# EAGLE design Pi64 (EAGLE 9.2.1)

## Sheet 1 of 4
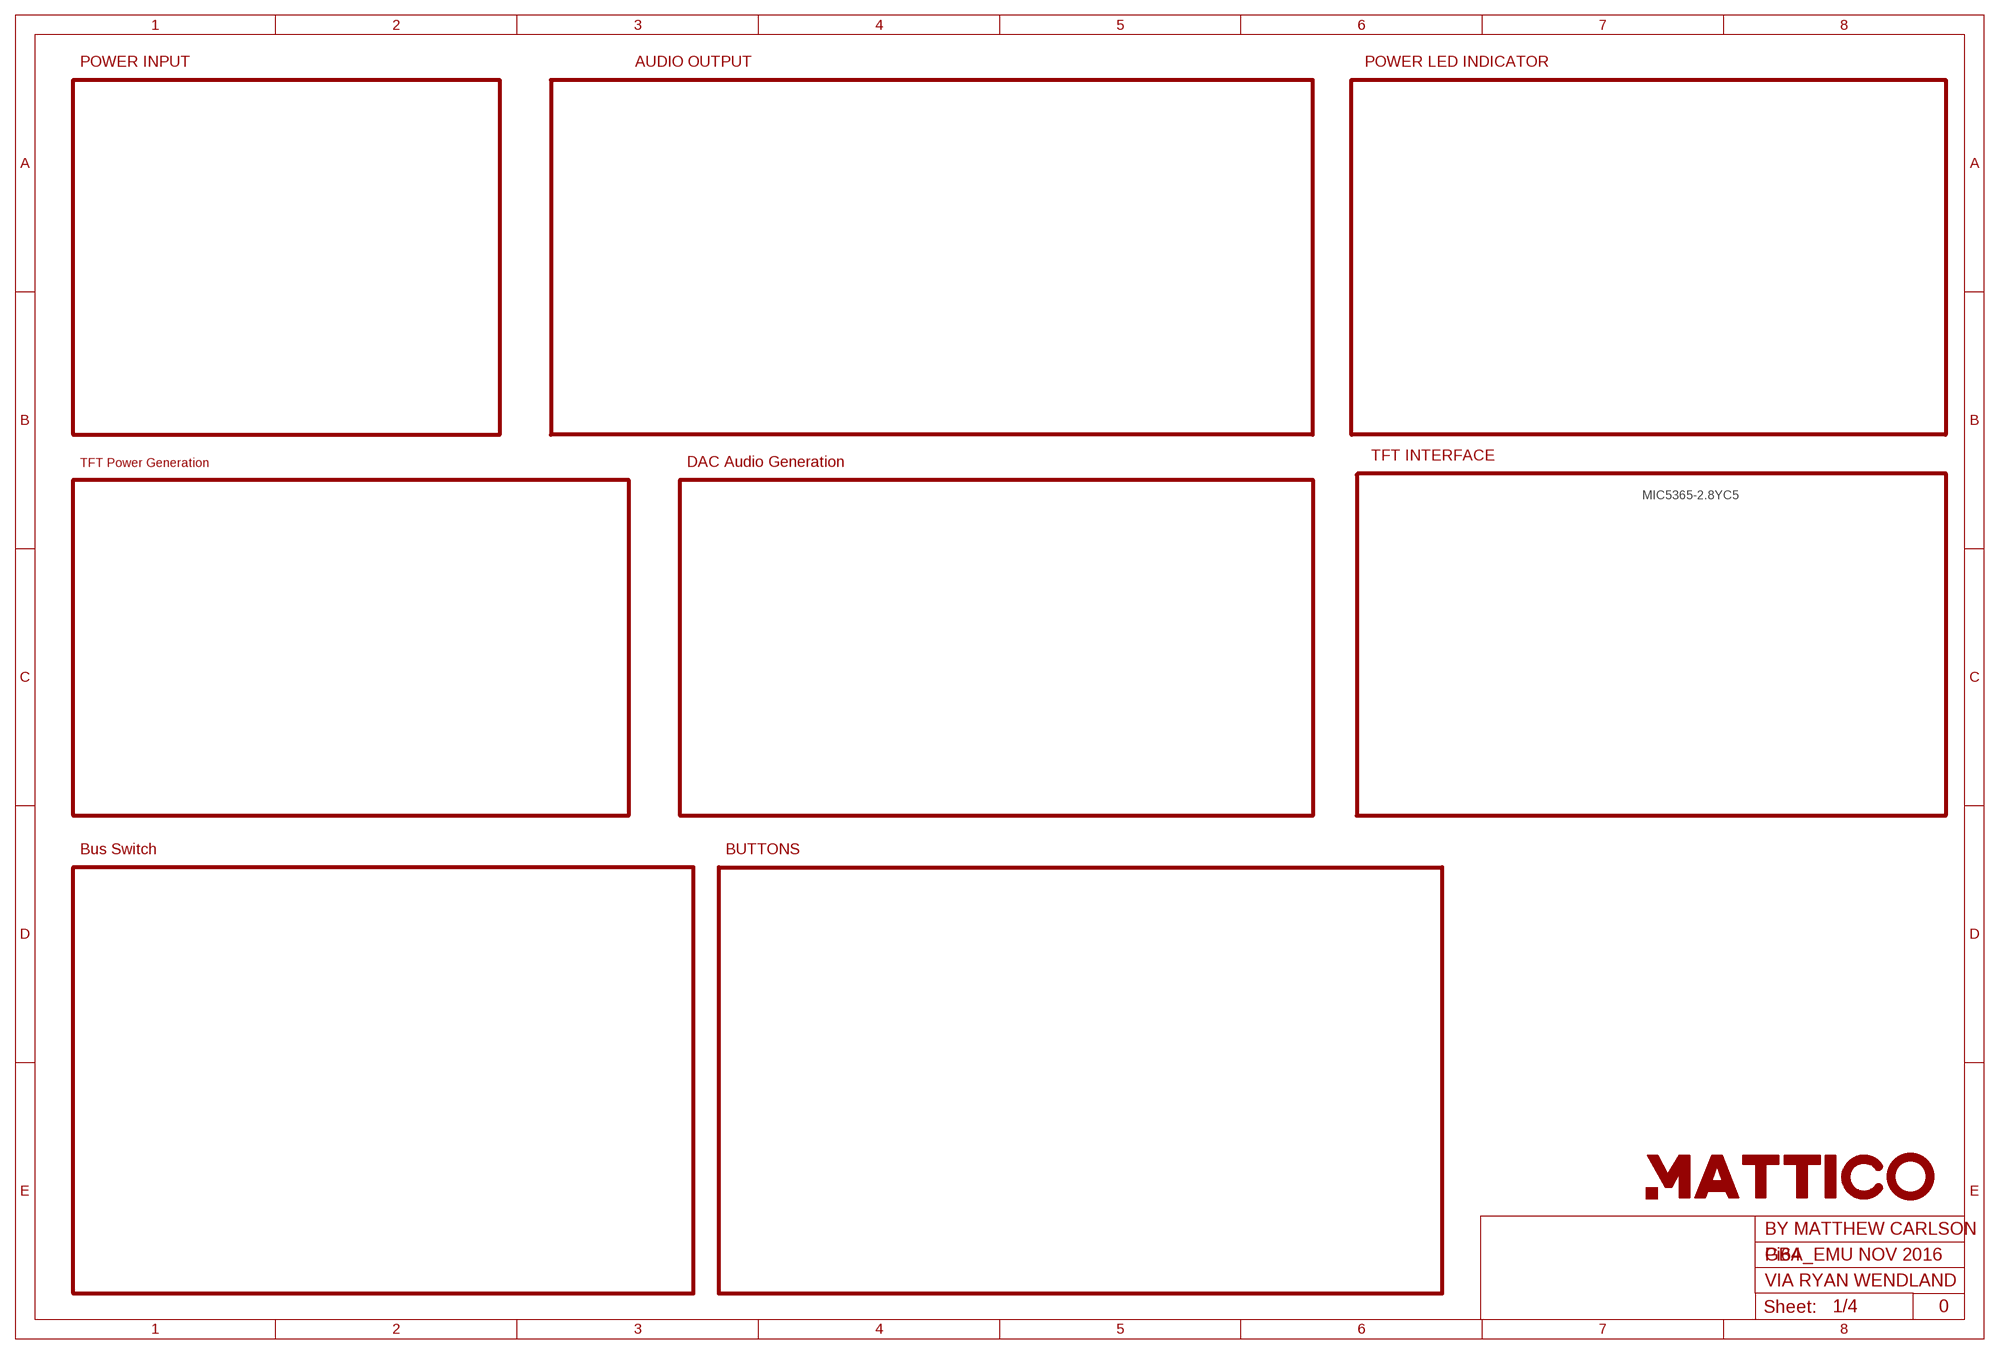
[diagram p0: schematic, sheet 1]

### Parts
U$2  LOGO2INCH_SVG  [LOGO_2INCH_SVG]

### Notes on the sheet
- POWER INPUT | AUDIO OUTPUT | POWER LED INDICATOR
- TFT INTERFACE
- TFT Power Generation | DAC Audio Generation
- MIC5365-2.8YC5
- Bus Switch | BUTTONS
- BY MATTHEW CARLSON
- GBA_EMU NOV 2016
- VIA RYAN WENDLAND
- 0

## Sheet 2 of 4
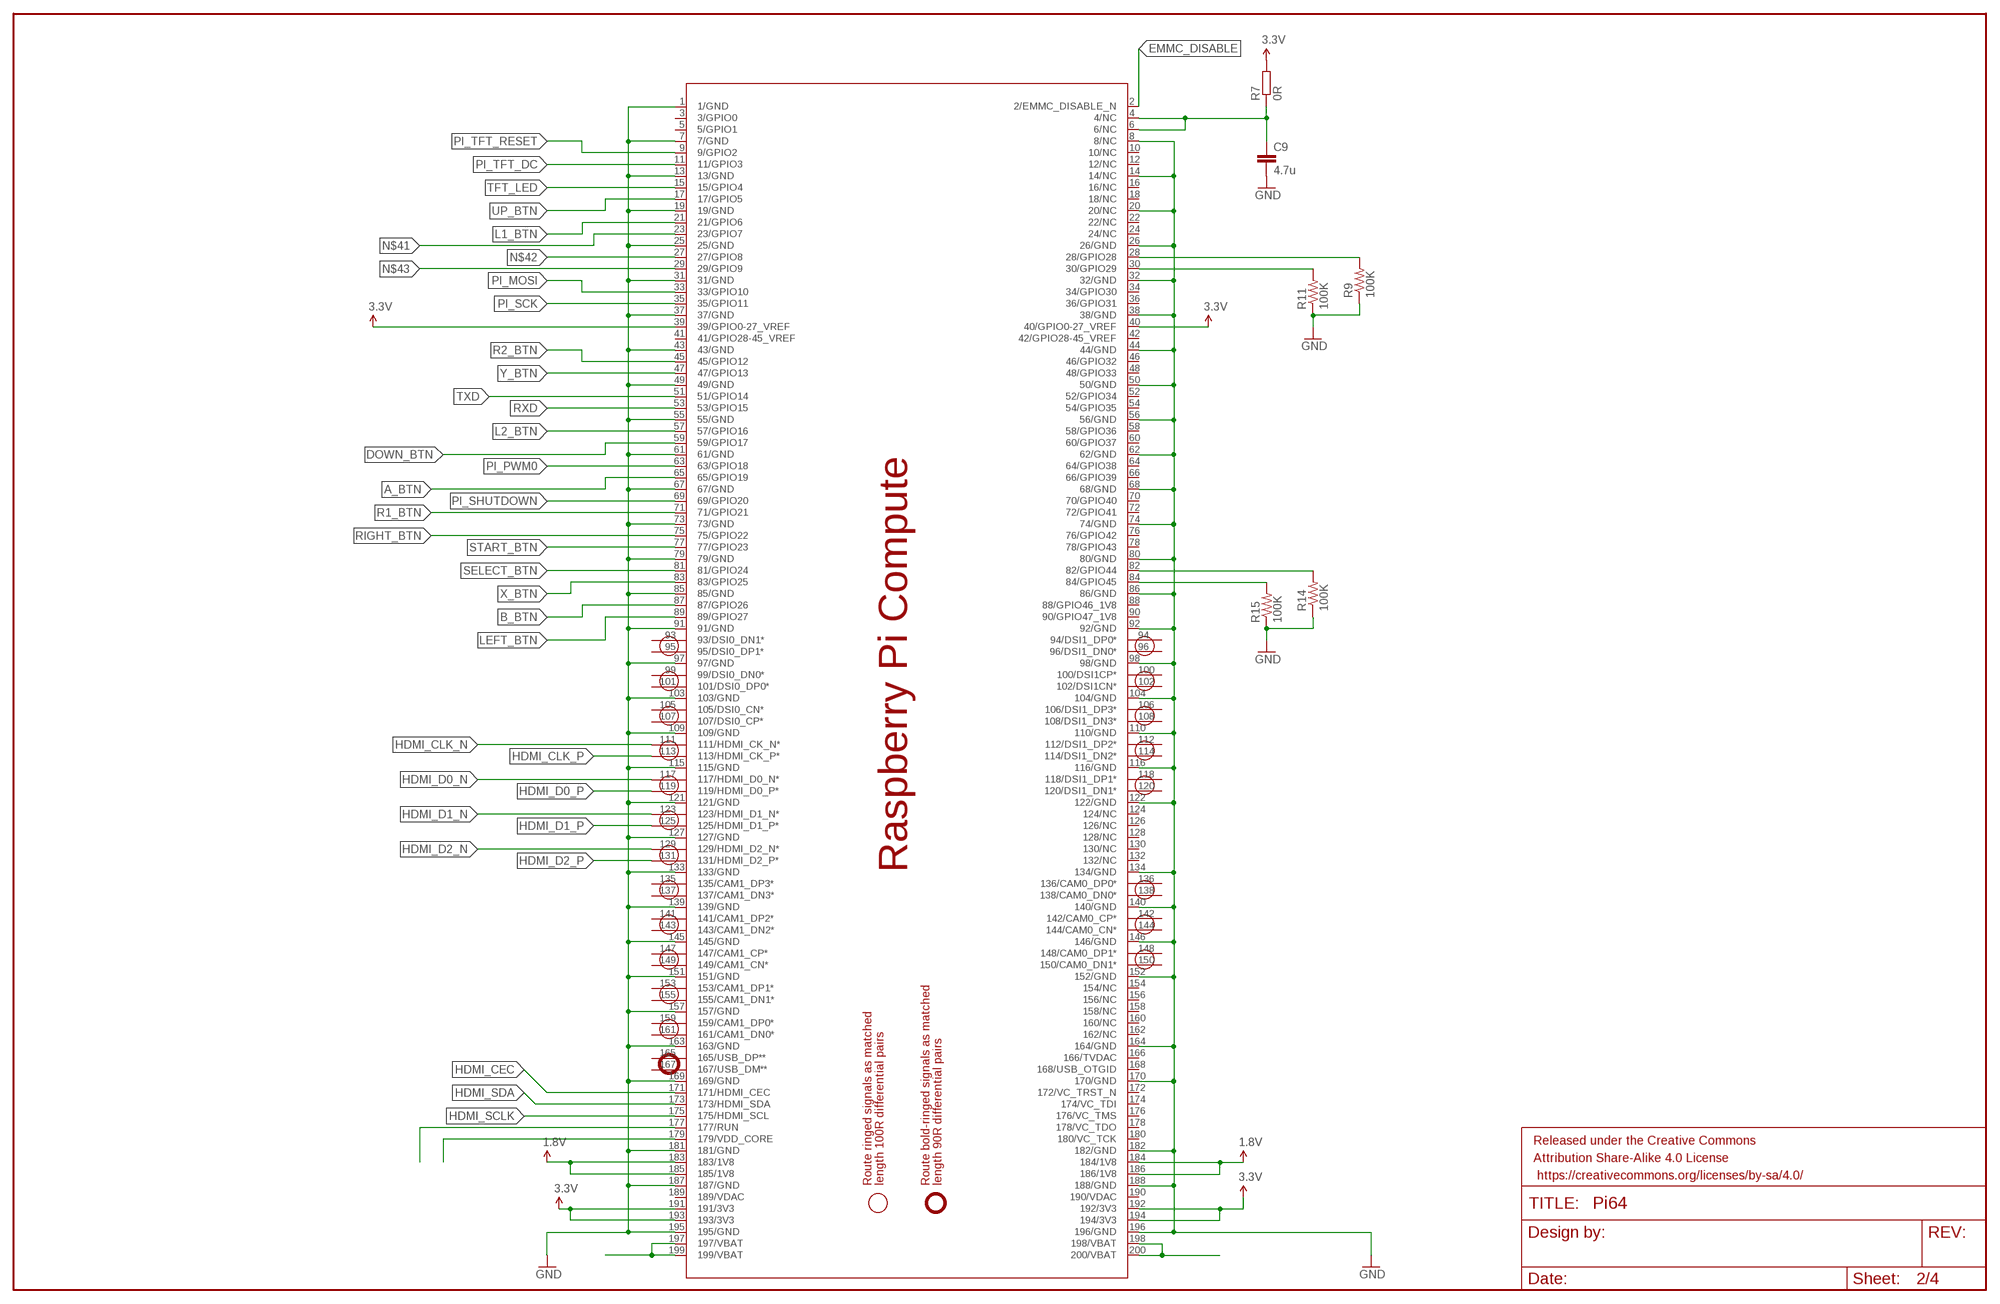
[diagram p1: schematic, sheet 2]

### Parts
C9  4.7u  C-EUC1608  [C1608]
FRAME2  FRAME-LEDGER  [CREATIVE_COMMONS]
PCB1  RPI_COMPUTE  [RPI_COMPUTE]
R7  0R  R-EU_R2012  [R2012]
R9  100K  R-US_R0805  [R0805]
R11  100K  R-US_R0805  [R0805]
R14  100K  R-US_R0805  [R0805]
R15  100K  R-US_R0805  [R0805]

### Nets
1.8V: PCB1.183(183/1V8) PCB1.184(184/1V8) PCB1.185(185/1V8) PCB1.186(186/1V8) ; also sheet 3
3.3V: PCB1.39(39/GPIO0-27_VREF) PCB1.40(40/GPIO0-27_VREF) PCB1.191(191/3V3) PCB1.192(192/3V3) PCB1.193(193/3V3) PCB1.194(194/3V3) R7.2 ; also sheet 3
A_BTN: PCB1.65(65/GPIO19)
B_BTN: PCB1.87(87/GPIO26)
DOWN_BTN: PCB1.59(59/GPIO17)
EMMC_DISABLE: PCB1.2(2/EMMC_DISABLE_N)
GND: C9.2 PCB1.1(1/GND) PCB1.7(7/GND) PCB1.8(8/NC) PCB1.13(13/GND) PCB1.14(14/NC) PCB1.19(19/GND) PCB1.20(20/NC) PCB1.25(25/GND) PCB1.26(26/GND) PCB1.31(31/GND) PCB1.32(32/GND) PCB1.37(37/GND) PCB1.38(38/GND) PCB1.43(43/GND) PCB1.44(44/GND) PCB1.49(49/GND) PCB1.50(50/GND) PCB1.55(55/GND) PCB1.56(56/GND) PCB1.61(61/GND) PCB1.62(62/GND) PCB1.67(67/GND) PCB1.68(68/GND) PCB1.73(73/GND) PCB1.74(74/GND) PCB1.79(79/GND) PCB1.80(80/GND) PCB1.85(85/GND) PCB1.86(86/GND) PCB1.91(91/GND) PCB1.92(92/GND) PCB1.97(97/GND) PCB1.98(98/GND) PCB1.103(103/GND) PCB1.104(104/GND) PCB1.109(109/GND) PCB1.110(110/GND) PCB1.115(115/GND) PCB1.116(116/GND) PCB1.121(121/GND) PCB1.122(122/GND) PCB1.127(127/GND) PCB1.133(133/GND) PCB1.134(134/GND) PCB1.139(139/GND) PCB1.140(140/GND) PCB1.145(145/GND) PCB1.146(146/GND) PCB1.151(151/GND) PCB1.152(152/GND) PCB1.157(157/GND) PCB1.163(163/GND) PCB1.164(164/GND) PCB1.169(169/GND) PCB1.170(170/GND) PCB1.181(181/GND) PCB1.182(182/GND) PCB1.187(187/GND) PCB1.188(188/GND) PCB1.195(195/GND) PCB1.196(196/GND) R9.1 R11.1 R14.1 R15.1 ; also sheet 3
HDMI_CEC [diff pairs]: PCB1.171(171/HDMI_CEC)
HDMI_CLK_N [diff pairs]: PCB1.111(111/HDMI_CK_N*)
HDMI_CLK_P [diff pairs]: PCB1.113(113/HDMI_CK_P*)
HDMI_D0_N [diff pairs]: PCB1.117(117/HDMI_D0_N*)
HDMI_D0_P [diff pairs]: PCB1.119(119/HDMI_D0_P*)
HDMI_D1_N [diff pairs]: PCB1.123(123/HDMI_D1_N*)
HDMI_D1_P [diff pairs]: PCB1.125(125/HDMI_D1_P*)
HDMI_D2_N [diff pairs]: PCB1.129(129/HDMI_D2_N*)
HDMI_D2_P [diff pairs]: PCB1.131(131/HDMI_D2_P*)
HDMI_SCLK: PCB1.175(175/HDMI_SCL)
HDMI_SDA: PCB1.173(173/HDMI_SDA)
L1_BTN: PCB1.21(21/GPIO6)
L2_BTN: PCB1.57(57/GPIO16)
LEFT_BTN: PCB1.89(89/GPIO27)
N$1: C9.1 PCB1.4(4/NC) PCB1.6(6/NC) R7.1
N$17: PCB1.28(28/GPIO28) R9.2
N$20: PCB1.30(30/GPIO29) R11.2
N$26: R14.2
N$27: R15.2
N$30: PCB1.179(179/VDD_CORE)
N$35: PCB1.177(177/RUN)
N$36: PCB1.197(197/VBAT) PCB1.199(199/VBAT)
N$37: PCB1.198(198/VBAT) PCB1.200(200/VBAT)
N$41: PCB1.23(23/GPIO7)
N$42: PCB1.27(27/GPIO8)
N$43: PCB1.29(29/GPIO9)
PI_MOSI: PCB1.33(33/GPIO10)
PI_PWM0: PCB1.63(63/GPIO18)
PI_SCK: PCB1.35(35/GPIO11)
PI_SHUTDOWN: PCB1.69(69/GPIO20)
PI_TFT_DC: PCB1.11(11/GPIO3)
PI_TFT_RESET: PCB1.9(9/GPIO2)
R1_BTN: PCB1.71(71/GPIO21)
R2_BTN: PCB1.45(45/GPIO12)
RIGHT_BTN: PCB1.75(75/GPIO22)
RXD: PCB1.53(53/GPIO15)
SELECT_BTN: PCB1.81(81/GPIO24)
START_BTN: PCB1.77(77/GPIO23)
TFT_LED: PCB1.15(15/GPIO4)
TXD: PCB1.51(51/GPIO14)
UP_BTN: PCB1.17(17/GPIO5)
X_BTN: PCB1.83(83/GPIO25)
Y_BTN: PCB1.47(47/GPIO13)
Unconnected: PCB1.3(3/GPIO0) PCB1.5(5/GPIO1) PCB1.10(10/NC) PCB1.12(12/NC) PCB1.16(16/NC) PCB1.18(18/NC) PCB1.22(22/NC) PCB1.24(24/NC) PCB1.34(34/GPIO30) PCB1.36(36/GPIO31) PCB1.41(41/GPIO28-45_VREF) PCB1.42(42/GPIO28-45_VREF) PCB1.46(46/GPIO32) PCB1.48(48/GPIO33) PCB1.52(52/GPIO34) PCB1.54(54/GPIO35) PCB1.58(58/GPIO36) PCB1.60(60/GPIO37) PCB1.64(64/GPIO38) PCB1.66(66/GPIO39) PCB1.70(70/GPIO40) PCB1.72(72/GPIO41) PCB1.76(76/GPIO42) PCB1.78(78/GPIO43) PCB1.82(82/GPIO44) PCB1.84(84/GPIO45) PCB1.88(88/GPIO46_1V8) PCB1.90(90/GPIO47_1V8) PCB1.93(93/DSI0_DN1*) PCB1.94(94/DSI1_DP0*) PCB1.95(95/DSI0_DP1*) PCB1.96(96/DSI1_DN0*) PCB1.99(99/DSI0_DN0*) PCB1.100(100/DSI1CP*) PCB1.101(101/DSI0_DP0*) PCB1.102(102/DSI1CN*) PCB1.105(105/DSI0_CN*) PCB1.106(106/DSI1_DP3*) PCB1.107(107/DSI0_CP*) PCB1.108(108/DSI1_DN3*) PCB1.112(112/DSI1_DP2*) PCB1.114(114/DSI1_DN2*) PCB1.118(118/DSI1_DP1*) PCB1.120(120/DSI1_DN1*) PCB1.124(124/NC) PCB1.126(126/NC) PCB1.128(128/NC) PCB1.130(130/NC) PCB1.132(132/NC) PCB1.135(135/CAM1_DP3*) PCB1.136(136/CAM0_DP0*) PCB1.137(137/CAM1_DN3*) PCB1.138(138/CAM0_DN0*) PCB1.141(141/CAM1_DP2*) PCB1.142(142/CAM0_CP*) PCB1.143(143/CAM1_DN2*) PCB1.144(144/CAM0_CN*) PCB1.147(147/CAM1_CP*) PCB1.148(148/CAM0_DP1*) PCB1.149(149/CAM1_CN*) PCB1.150(150/CAM0_DN1*) PCB1.153(153/CAM1_DP1*) PCB1.154(154/NC) PCB1.155(155/CAM1_DN1*) PCB1.156(156/NC) PCB1.158(158/NC) PCB1.159(159/CAM1_DP0*) PCB1.160(160/NC) PCB1.161(161/CAM1_DN0*) PCB1.162(162/NC) PCB1.165(165/USB_DP**) PCB1.166(166/TVDAC) PCB1.167(167/USB_DM**) PCB1.168(168/USB_OTGID) PCB1.172(172/VC_TRST_N) PCB1.174(174/VC_TDI) PCB1.176(176/VC_TMS) PCB1.178(178/VC_TDO) PCB1.180(180/VC_TCK) PCB1.189(189/VDAC) PCB1.190(190/VDAC)

## Sheet 3 of 4
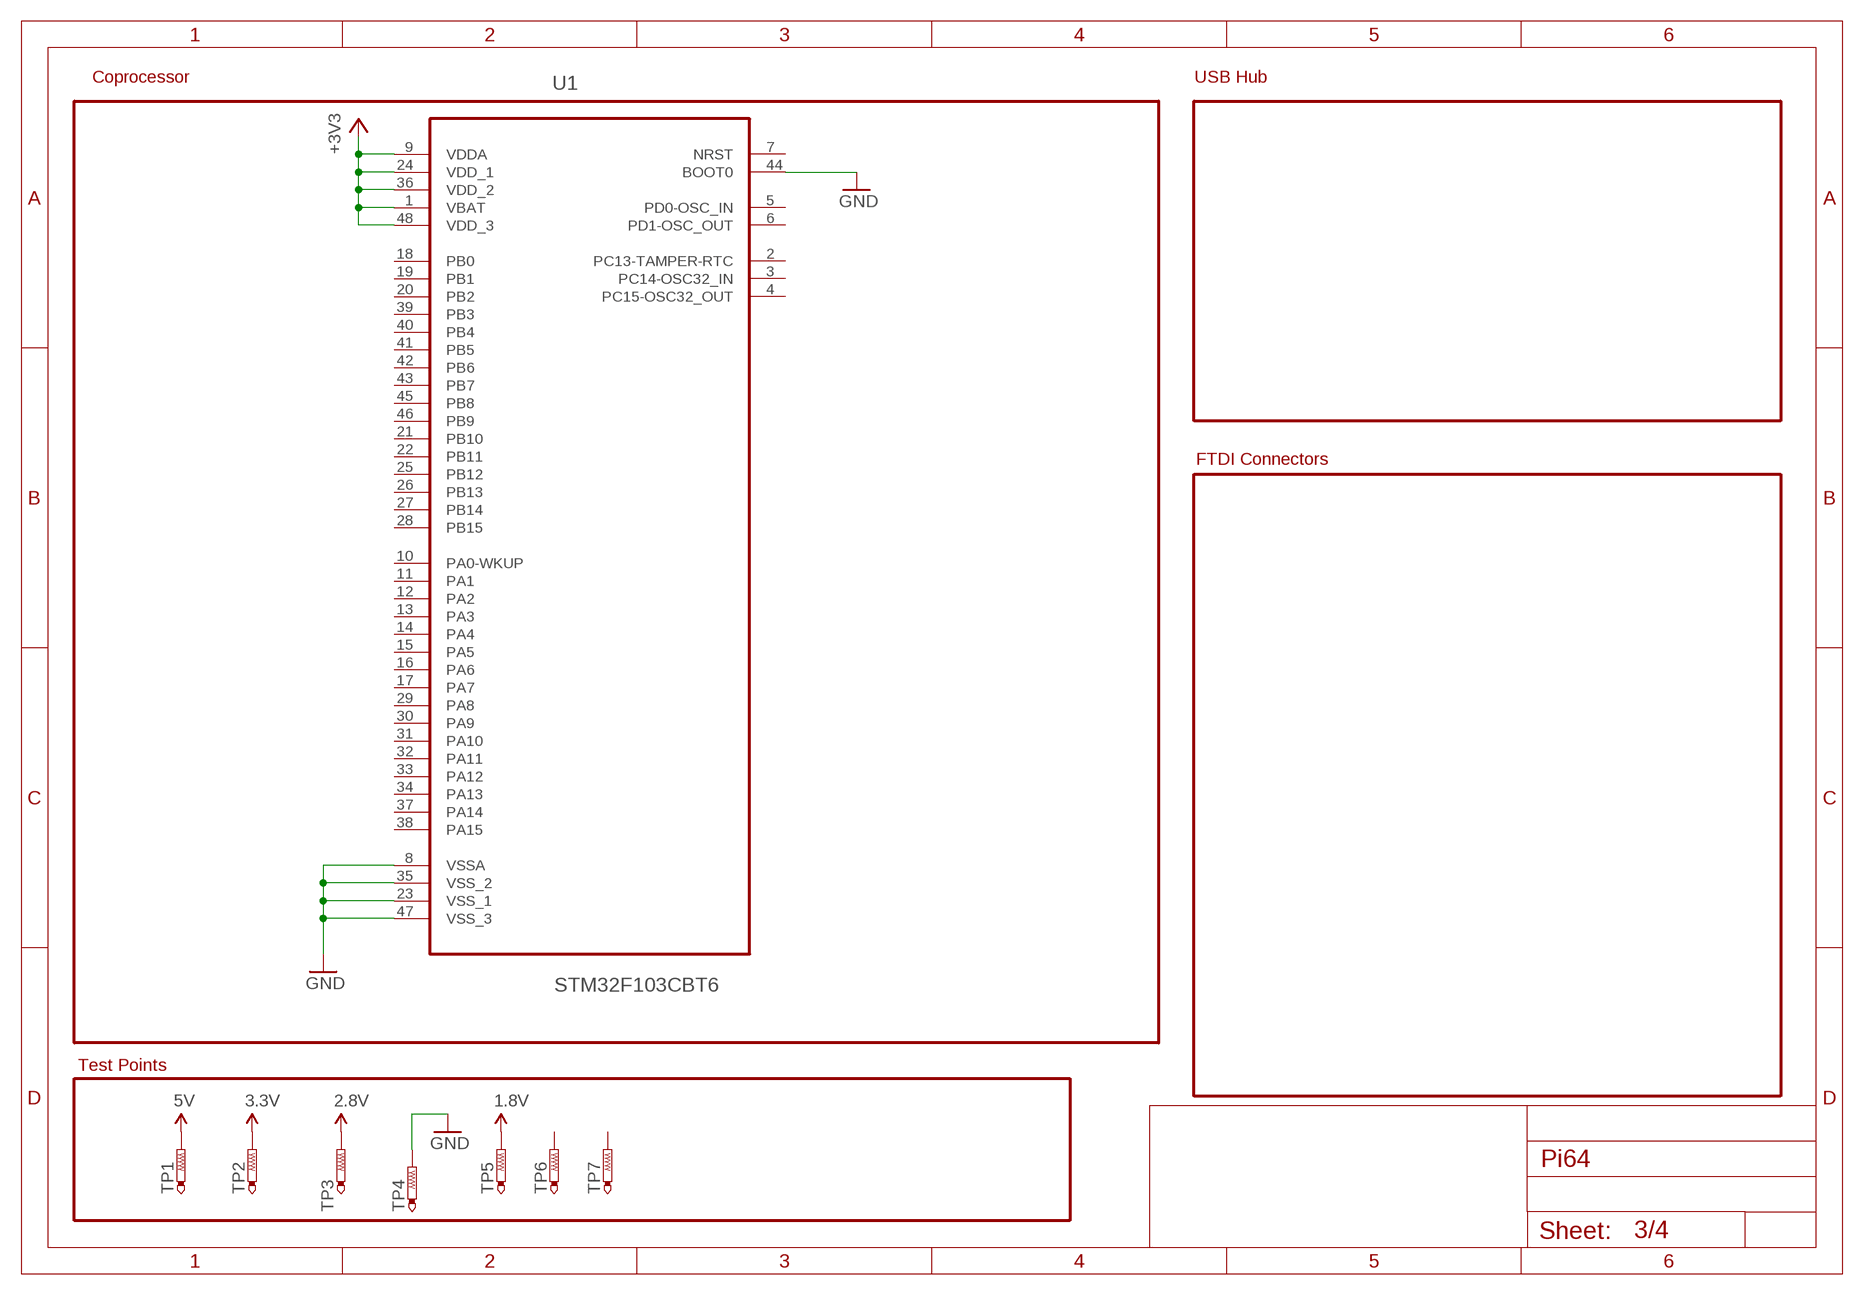
[diagram p2: schematic, sheet 3]

### Parts
TP1  PTR1TP12R  [TP12R]
TP2  PTR1TP12R  [TP12R]
TP3  PTR1TP12R  [TP12R]
TP4  PTR1TP12R  [TP12R]
TP5  PTR1TP12R  [TP12R]
TP6  PTR1TP12R  [TP12R]
TP7  PTR1TP12R  [TP12R]
U1  STM32F103CBT6  [QFP50P900X900X160-48N]

### Nets
1.8V: TP5.TP ; also sheet 2
2.8V: TP3.TP
3.3V: TP2.TP ; also sheet 2
5V: TP1.TP
+3V3: U1.1(VBAT) U1.9(VDDA) U1.24(VDD_1) U1.36(VDD_2) U1.48(VDD_3)
GND: TP4.TP U1.8(VSSA) U1.23(VSS_1) U1.35(VSS_2) U1.44(BOOT0) U1.47(VSS_3) ; also sheet 2
Unconnected: TP6.TP TP7.TP U1.2(PC13-TAMPER-RTC) U1.3(PC14-OSC32_IN) U1.4(PC15-OSC32_OUT) U1.5(PD0-OSC_IN) U1.6(PD1-OSC_OUT) U1.7(NRST) U1.10(PA0-WKUP) U1.11(PA1) U1.12(PA2) U1.13(PA3) U1.14(PA4) U1.15(PA5) U1.16(PA6) U1.17(PA7) U1.18(PB0) U1.19(PB1) U1.20(PB2) U1.21(PB10) U1.22(PB11) U1.25(PB12) U1.26(PB13) U1.27(PB14) U1.28(PB15) U1.29(PA8) U1.30(PA9) U1.31(PA10) U1.33(PA12) U1.34(PA13) U1.37(PA14) U1.38(PA15) U1.39(PB3) U1.40(PB4) U1.41(PB5) U1.42(PB6) U1.43(PB7) U1.45(PB8) U1.46(PB9)

### Notes on the sheet
- Coprocessor | USB Hub
- FTDI Connectors
- Test Points

## Sheet 4 of 4
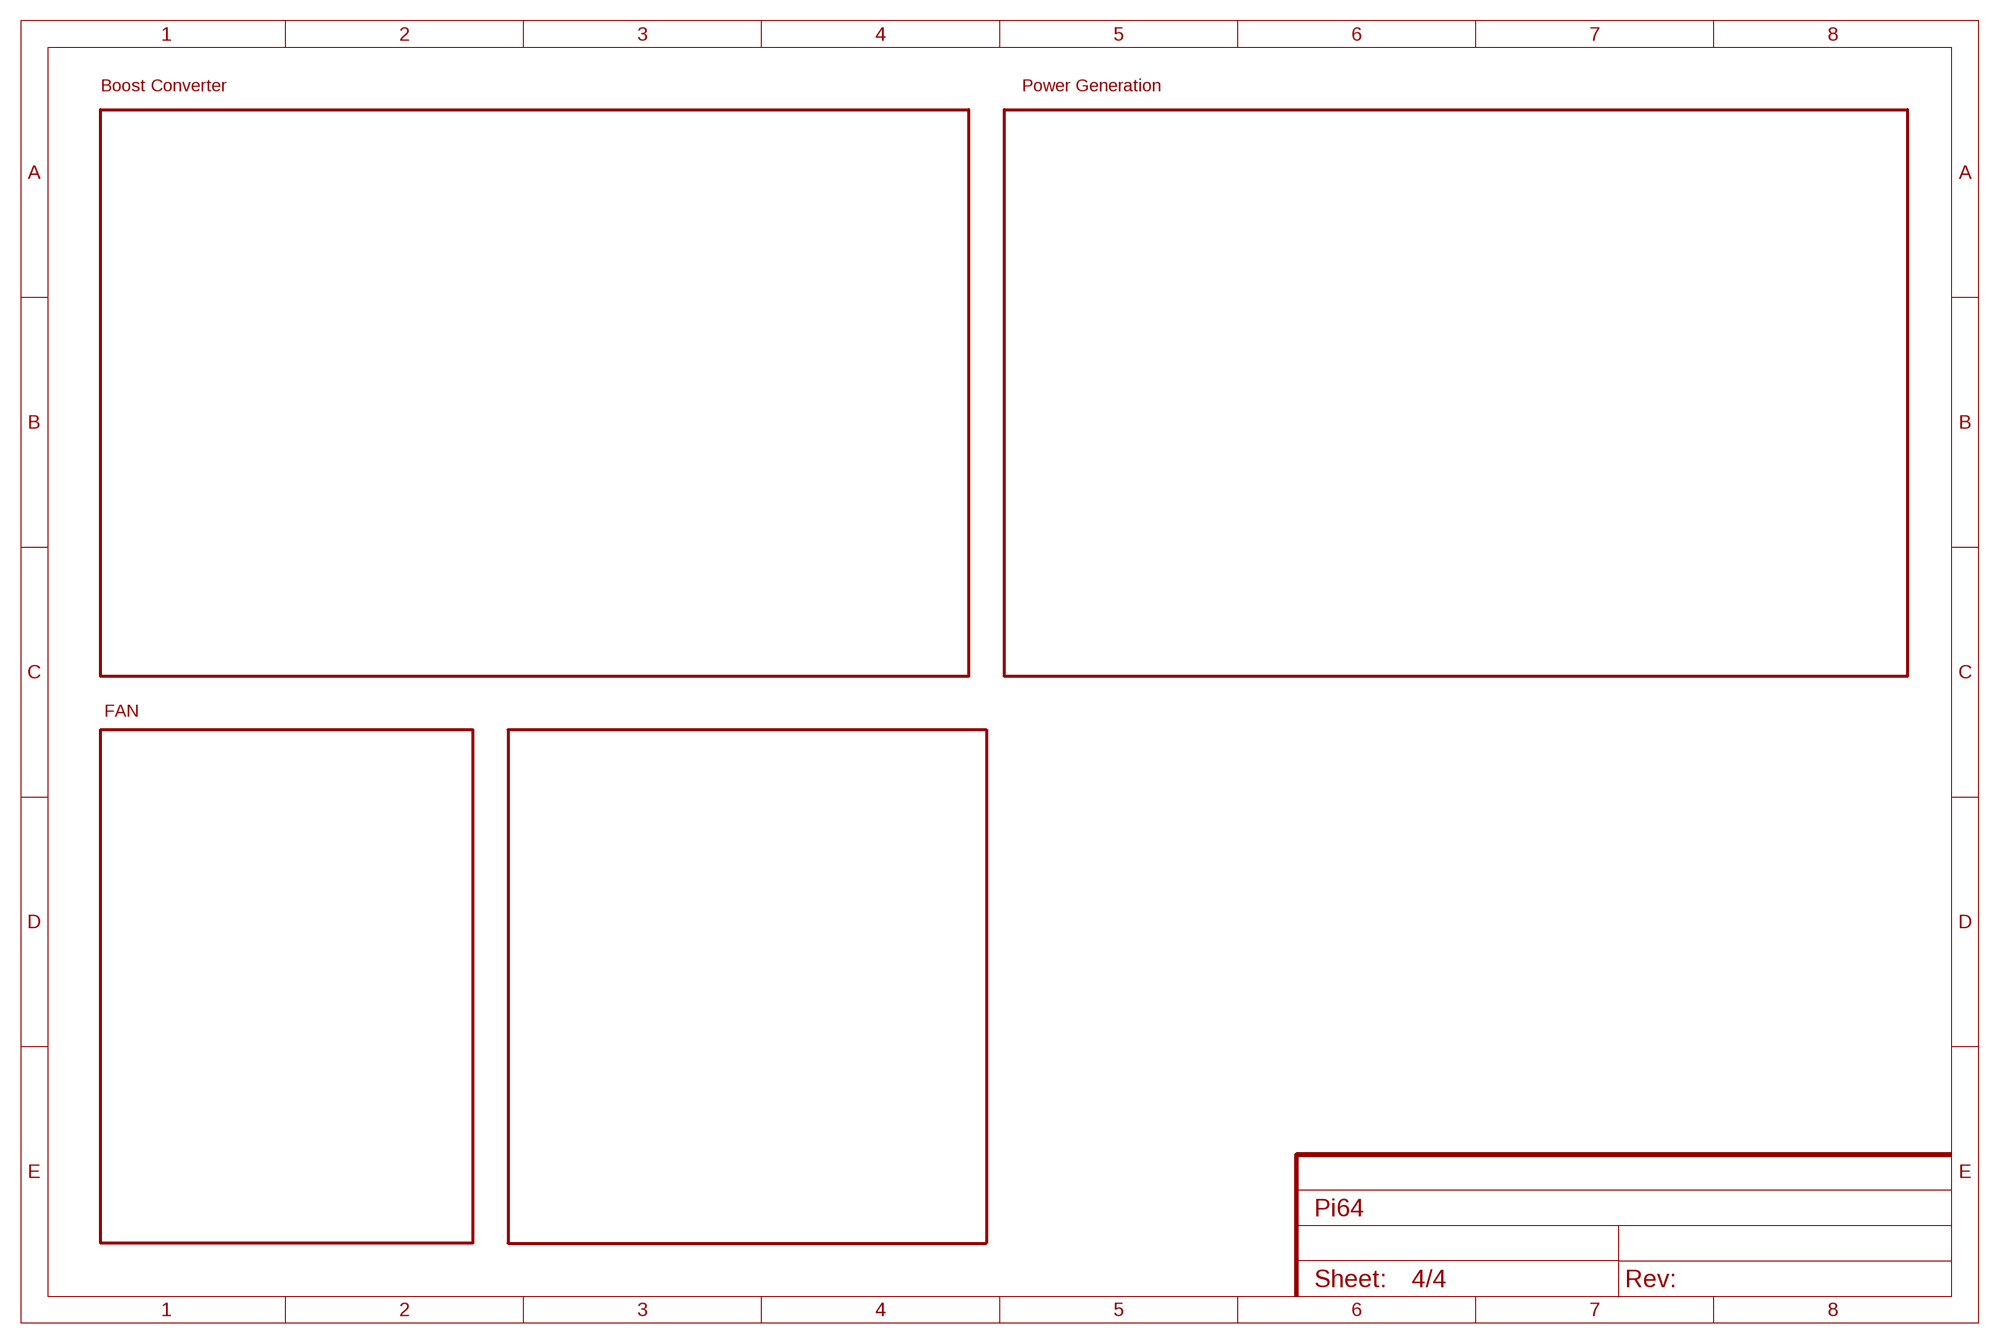
[diagram p3: schematic, sheet 4]

### Notes on the sheet
- Boost Converter | Power Generation
- FAN

## Power pins joined to a net without a drawn wire
PA11: U1.32(PA11)

## Library data of the parts
C9 = rcl:C-EU: CAPACITOR, European symbol; SPICEPREFIX: C
FRAME2 = SparkFun-Aesthetics:FRAME-LEDGER: Schematic Frame Standard 11x14 US Ledger frame
PCB1 = e14_Rpi_Compute_RevC:RPI_COMPUTE: Device for a Raspberry PI Compute module. Note that the package is for a DDR2 connector of 'standard' orientation. Example: TE Connectivity P/N: 1565917-4, Newark P/N: 08P0616, Farnell P/N: 2112525 More information is available at http://www.element14.com/community/community/raspberry-pi/raspberry-pi-compute-module
R7 = rcl:R-EU_: RESISTOR, European symbol; SPICEPREFIX: R
R9 R11 R14 R15 = rcl:R-US_: RESISTOR, American symbol; SPICEPREFIX: R
TP1-TP7 = testpad:PTR1: TEST PIN
U1 = custom:STM32F103CBT6: Medium-density performance line ARM-based 32-bit MCU; DESCRIPTION: Mainstream Performance line, ARM Cortex-M3 MCU with 128 Kbytes Flash, 72 MHz CPU, motor control, USB and CAN; DIGI-KEY_PART_NUMBER: 497-6288-ND; DIGI-KEY_PURCHASE_URL: https://www.digikey.com/product-detail/en/stmicroelectronics/STM32F103CBT6/497-6288-ND/1754420?utm_source=snapeda&utm_medium=aggregator&utm_campaign=symbol; MF: STMicroelectronics; MP: STM32F103CBT6; PACKAGE: LQFP-48 STMicroelectronics
U$2 = custom:LOGO

## Net classes
1 diff pairs: width 0.406 mm

## Board
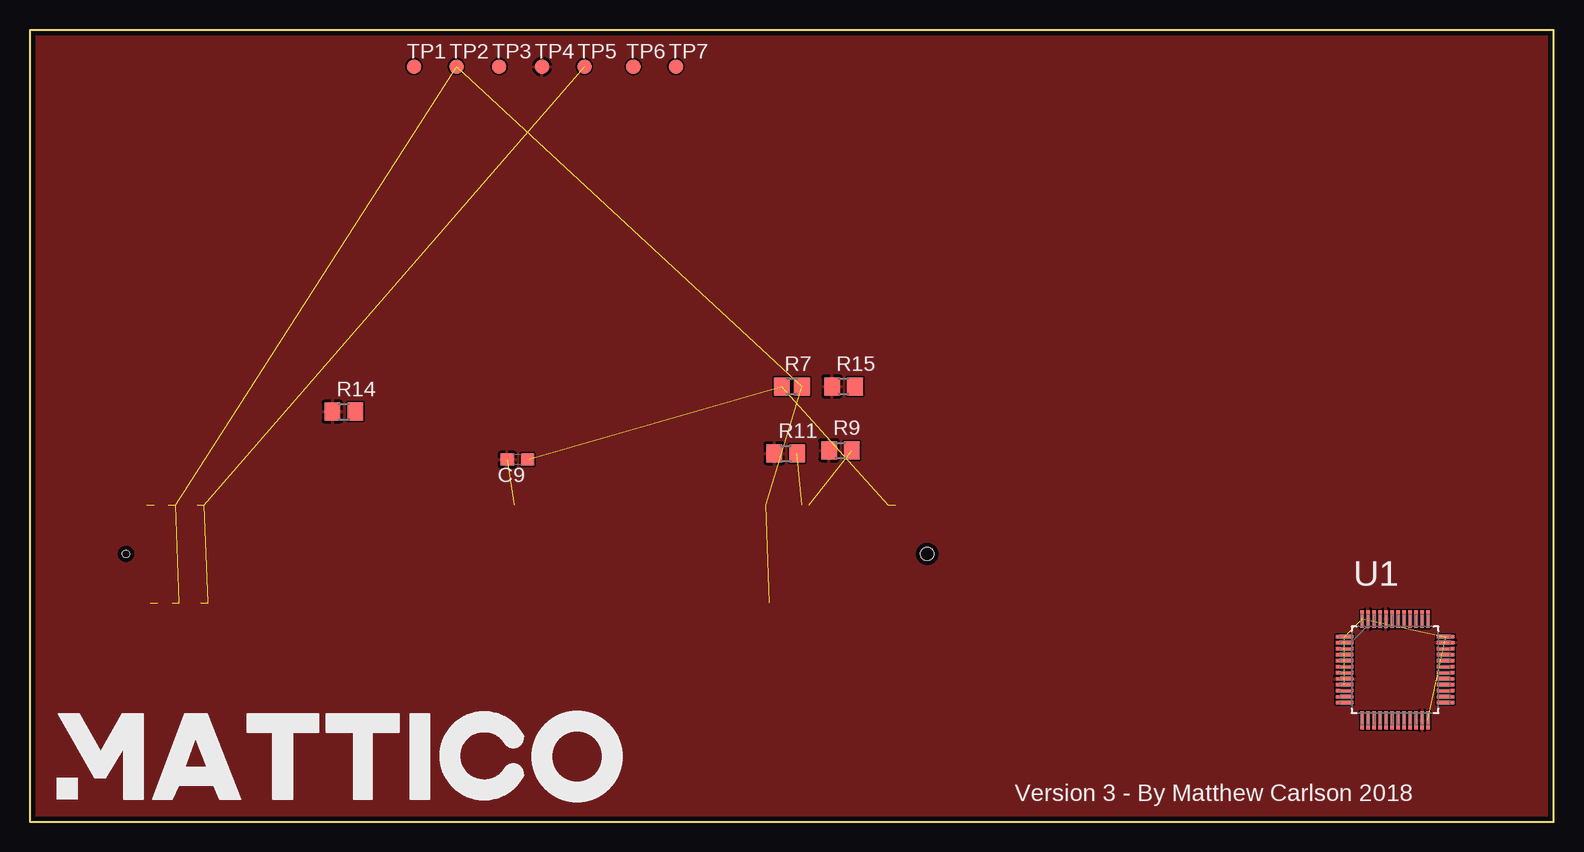
[diagram p4: board, top side]
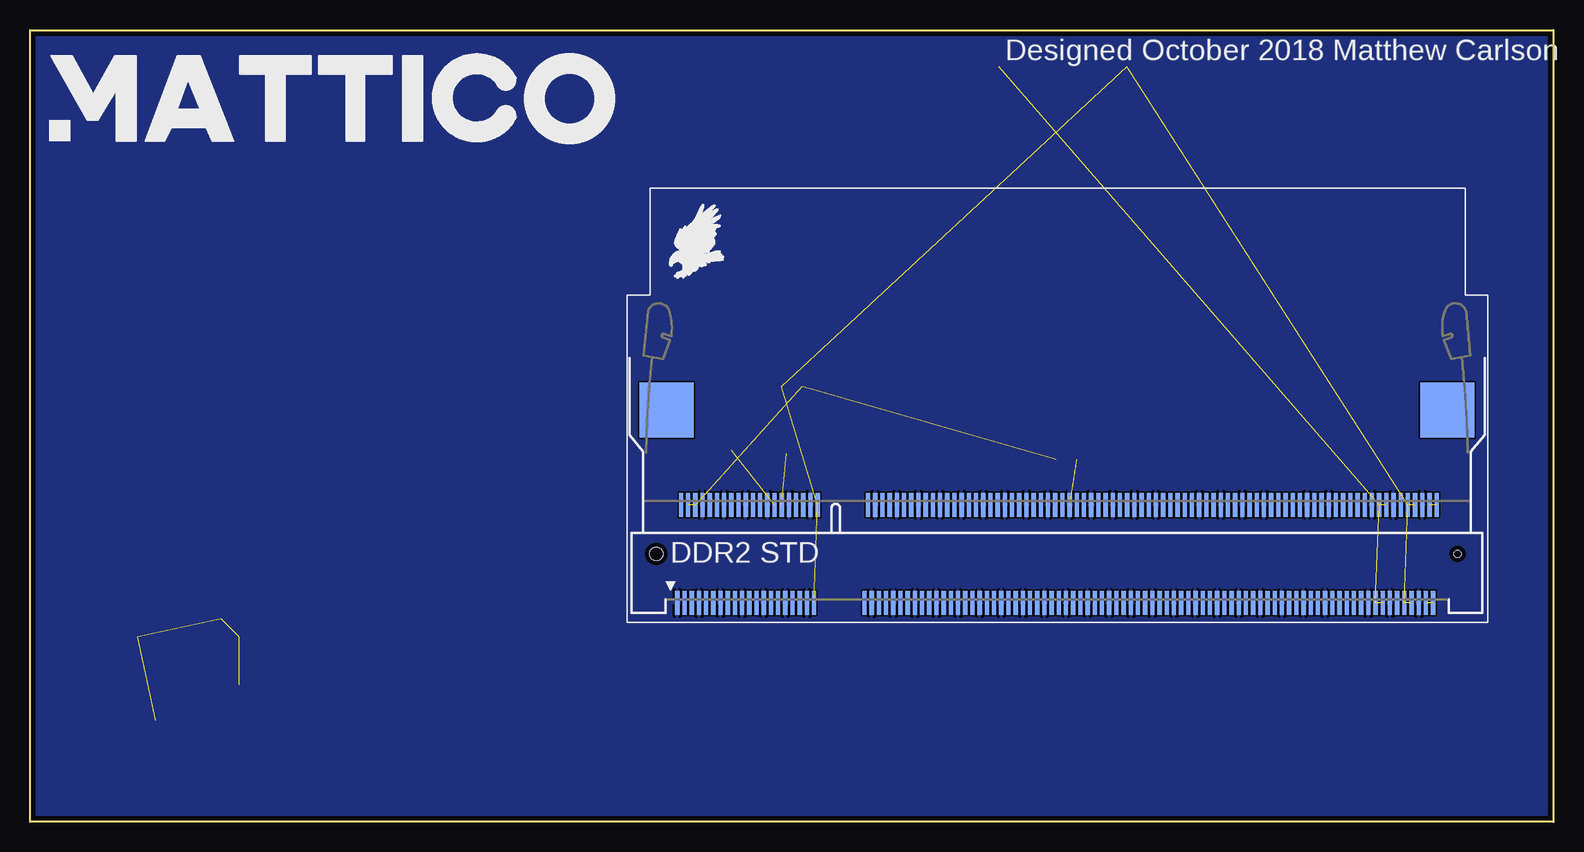
[diagram p5: board, bottom side, seen from below]

Size 127 x 66.04 mm. Coordinates in mm from the lower left corner, seen from the top.
Outline: 0,0 0,66.04 127,66.04 127,0 0,0
Copper layers (1*16): Top 0.0356mm / dielectric 1.5011mm / Bottom 0.0356mm
Design rules "oshpark-2layer": minimum track width 6mil, minimum drill 13mil, track to track 6mil, track to pad 6mil, pad to pad 6mil, via to via 6mil, smd to smd 6mil, copper to edge 15mil, drill to drill 6mil, minimum pad ring 7mil, minimum via ring 7mil, stop-mask expansion 2.5mil, vias tented up to drill 0mil, thermal gap 10mil

### Footprints (pad centres in the part's own frame; a part is rotated, then mirrored left to right if it is on the bottom)
C1608 = smd 1.1 x 1: 1 -0.85,0; 2 0.85,0
RPI_COMPUTE = smd 0.35 x 2: 1 -31.38,-4.1; 2 -31.08,4.1; 3 -30.78,-4.1; 4 -30.48,4.1; 5 -30.18,-4.1; 6 -29.88,4.1; 7 -29.58,-4.1; 8 -29.28,4.1; 9 -28.98,-4.1; 10 -28.68,4.1; 11 -28.38,-4.1; 12 -28.08,4.1; 13 -27.78,-4.1; 14 -27.48,4.1; 15 -27.18,-4.1; 16 -26.88,4.1; 17 -26.58,-4.1; 18 -26.28,4.1; 19 -25.98,-4.1; 20 -25.68,4.1; 21 -25.38,-4.1; 22 -25.08,4.1; 23 -24.78,-4.1; 24 -24.48,4.1; 25 -24.18,-4.1; 26 -23.88,4.1; 27 -23.58,-4.1; 28 -23.28,4.1; 29 -22.98,-4.1; 30 -22.68,4.1; 31 -22.38,-4.1; 32 -22.08,4.1; 33 -21.78,-4.1; 34 -21.48,4.1; 35 -21.18,-4.1; 36 -20.88,4.1; 37 -20.58,-4.1; 38 -20.28,4.1; 39 -19.98,-4.1; 40 -19.68,4.1; 41 -15.78,-4.1; 42 -15.48,4.1; 43 -15.18,-4.1; 44 -14.88,4.1; 45 -14.58,-4.1; 46 -14.28,4.1; 47 -13.98,-4.1; 48 -13.68,4.1; 49 -13.38,-4.1; 50 -13.08,4.1; 51 -12.78,-4.1; 52 -12.48,4.1; 53 -12.18,-4.1; 54 -11.88,4.1; 55 -11.58,-4.1; 56 -11.28,4.1; 57 -10.98,-4.1; 58 -10.68,4.1; 59 -10.38,-4.1; 60 -10.08,4.1; 61 -9.78,-4.1; 62 -9.48,4.1; 63 -9.18,-4.1; 64 -8.88,4.1; 65 -8.58,-4.1; 66 -8.28,4.1; 67 -7.98,-4.1; 68 -7.68,4.1; 69 -7.38,-4.1; 70 -7.08,4.1; 71 -6.78,-4.1; 72 -6.48,4.1; 73 -6.18,-4.1; 74 -5.88,4.1; 75 -5.58,-4.1; 76 -5.28,4.1; 77 -4.98,-4.1; 78 -4.68,4.1; 79 -4.38,-4.1; 80 -4.08,4.1; 81 -3.78,-4.1; 82 -3.48,4.1; 83 -3.18,-4.1; 84 -2.88,4.1; 85 -2.58,-4.1; 86 -2.28,4.1; 87 -1.98,-4.1; 88 -1.68,4.1; 89 -1.38,-4.1; 90 -1.08,4.1; 91 -0.78,-4.1; 92 -0.48,4.1; 93 -0.18,-4.1; 94 0.12,4.1; 95 0.42,-4.1; 96 0.72,4.1; 97 1.02,-4.1; 98 1.32,4.1; 99 1.62,-4.1; 100 1.92,4.1; 101 2.22,-4.1; 102 2.52,4.1; 103 2.82,-4.1; 104 3.12,4.1; 105 3.42,-4.1; 106 3.72,4.1; 107 4.02,-4.1; 108 4.32,4.1; 109 4.62,-4.1; 110 4.92,4.1; 111 5.22,-4.1; 112 5.52,4.1; 113 5.82,-4.1; 114 6.12,4.1; 115 6.42,-4.1; 116 6.72,4.1; 117 7.02,-4.1; 118 7.32,4.1; 119 7.62,-4.1; 120 7.92,4.1; 121 8.22,-4.1; 122 8.52,4.1; 123 8.82,-4.1; 124 9.12,4.1; 125 9.42,-4.1; 126 9.72,4.1; 127 10.02,-4.1; 128 10.32,4.1; 129 10.62,-4.1; 130 10.92,4.1; 131 11.22,-4.1; 132 11.52,4.1; 133 11.82,-4.1; 134 12.12,4.1; 135 12.42,-4.1; 136 12.72,4.1; 137 13.02,-4.1; 138 13.32,4.1; 139 13.62,-4.1; 140 13.92,4.1; 141 14.22,-4.1; 142 14.52,4.1; 143 14.82,-4.1; 144 15.12,4.1; 145 15.42,-4.1; 146 15.72,4.1; 147 16.02,-4.1; 148 16.32,4.1; 149 16.62,-4.1; 150 16.92,4.1; 151 17.22,-4.1; 152 17.52,4.1; 153 17.82,-4.1; 154 18.12,4.1; 155 18.42,-4.1; 156 18.72,4.1; 157 19.02,-4.1; 158 19.32,4.1; 159 19.62,-4.1; 160 19.92,4.1; 161 20.22,-4.1; 162 20.52,4.1; 163 20.82,-4.1; 164 21.12,4.1; 165 21.42,-4.1; 166 21.72,4.1; 167 22.02,-4.1; 168 22.32,4.1; 169 22.62,-4.1; 170 22.92,4.1; 171 23.22,-4.1; 172 23.52,4.1; 173 23.82,-4.1; 174 24.12,4.1; 175 24.42,-4.1; 176 24.72,4.1; 177 25.02,-4.1; 178 25.32,4.1; 179 25.62,-4.1; 180 25.92,4.1; 181 26.22,-4.1; 182 26.52,4.1; 183 26.82,-4.1; 184 27.12,4.1; 185 27.42,-4.1; 186 27.72,4.1; 187 28.02,-4.1; 188 28.32,4.1; 189 28.62,-4.1; 190 28.92,4.1; 191 29.22,-4.1; 192 29.52,4.1; 193 29.82,-4.1; 194 30.12,4.1; 195 30.42,-4.1; 196 30.72,4.1; 197 31.02,-4.1; 198 31.32,4.1; 199 31.62,-4.1; 200 31.92,4.1 | smd 4.5 x 4.6: M1 -32.28,12; M2 32.82,12 | hole 1.1: -33.13,0 | hole 0.6: 33.67,0
R2012 = smd 1.3 x 1.5: 1 -0.85,0; 2 0.85,0
R0805 = smd 1.3 x 1.5: 1 -0.95,0; 2 0.95,0
TP12R = smd 1.2 x 1.2: TP 0,0
QFP50P900X900X160-48N = smd 1.473 x 0.279: 1 -4.216,2.743; 2 -4.216,2.261; 3 -4.216,1.753; 4 -4.216,1.245; 5 -4.216,0.762; 6 -4.216,0.254; 7 -4.216,-0.254; 8 -4.216,-0.762; 9 -4.216,-1.245; 10 -4.216,-1.753; 11 -4.216,-2.261; 12 -4.216,-2.743; 25 4.216,-2.743; 26 4.216,-2.261; 27 4.216,-1.753; 28 4.216,-1.245; 29 4.216,-0.762; 30 4.216,-0.254; 31 4.216,0.254; 32 4.216,0.762; 33 4.216,1.245; 34 4.216,1.753; 35 4.216,2.261; 36 4.216,2.743 | smd 0.279 x 1.473: 13 -2.743,-4.216; 14 -2.261,-4.216; 15 -1.753,-4.216; 16 -1.245,-4.216; 17 -0.762,-4.216; 18 -0.254,-4.216; 19 0.254,-4.216; 20 0.762,-4.216; 21 1.245,-4.216; 22 1.753,-4.216; 23 2.261,-4.216; 24 2.743,-4.216; 37 2.743,4.216; 38 2.261,4.216; 39 1.753,4.216; 40 1.245,4.216; 41 0.762,4.216; 42 0.254,4.216; 43 -0.254,4.216; 44 -0.762,4.216; 45 -1.245,4.216; 46 -1.753,4.216; 47 -2.261,4.216; 48 -2.743,4.216

### Placement (x,y rotation side)
C9  40.64,30.23 180 top
FRAME2  32,-9.65 0 top  (outside the outline)
PCB1  41.66,22.35 0 bottom
R7  63.5,36.32 0 top
R9  67.56,30.99 0 top
R11  62.99,30.73 0 top
R14  26.16,34.21 0 top
R15  67.82,36.32 0 top
TP1  32,62.99 0 top
TP2  35.56,62.99 0 top
TP3  39.12,62.99 0 top
TP4  42.67,62.99 0 top
TP5  46.23,62.99 0 top
TP6  50.29,62.99 0 top
TP7  53.85,62.99 0 top
U1  113.79,12.7 0 top
U$2  1.58,1.14 0 top
U$7  LOGO2INCH_SVG  [LOGO_2INCH_SVG]  126.04,56 0 bottom

### Tracks (layer width: path | path; a pad name or v marks a point on that pad's centre or on a via)
1.8V  (4 unrouted)
3.3V  (7 unrouted)
+3V3  (4 unrouted)
GND  (1 unrouted)
  pour Top: -2.03,67.06 129.54,67.06 129.54,-4.06 -2.03,-4.06
  pour Bottom: -0.51,67.06 128.02,67.06 128.02,-2.03 -0.51,-2.03
N$1  (3 unrouted)
N$17  (1 unrouted)
N$20  (1 unrouted)
N$36  (1 unrouted)
N$37  (1 unrouted)

### Text on the board
tPlace: Version 3 - By Matthew Carlson 2018
bPlace: Designed October 2018 Matthew Carlson